# EAGLE schematic Mixer-Analog-OPA1644-Rev-C.s#6 (EAGLE 8.4.3)
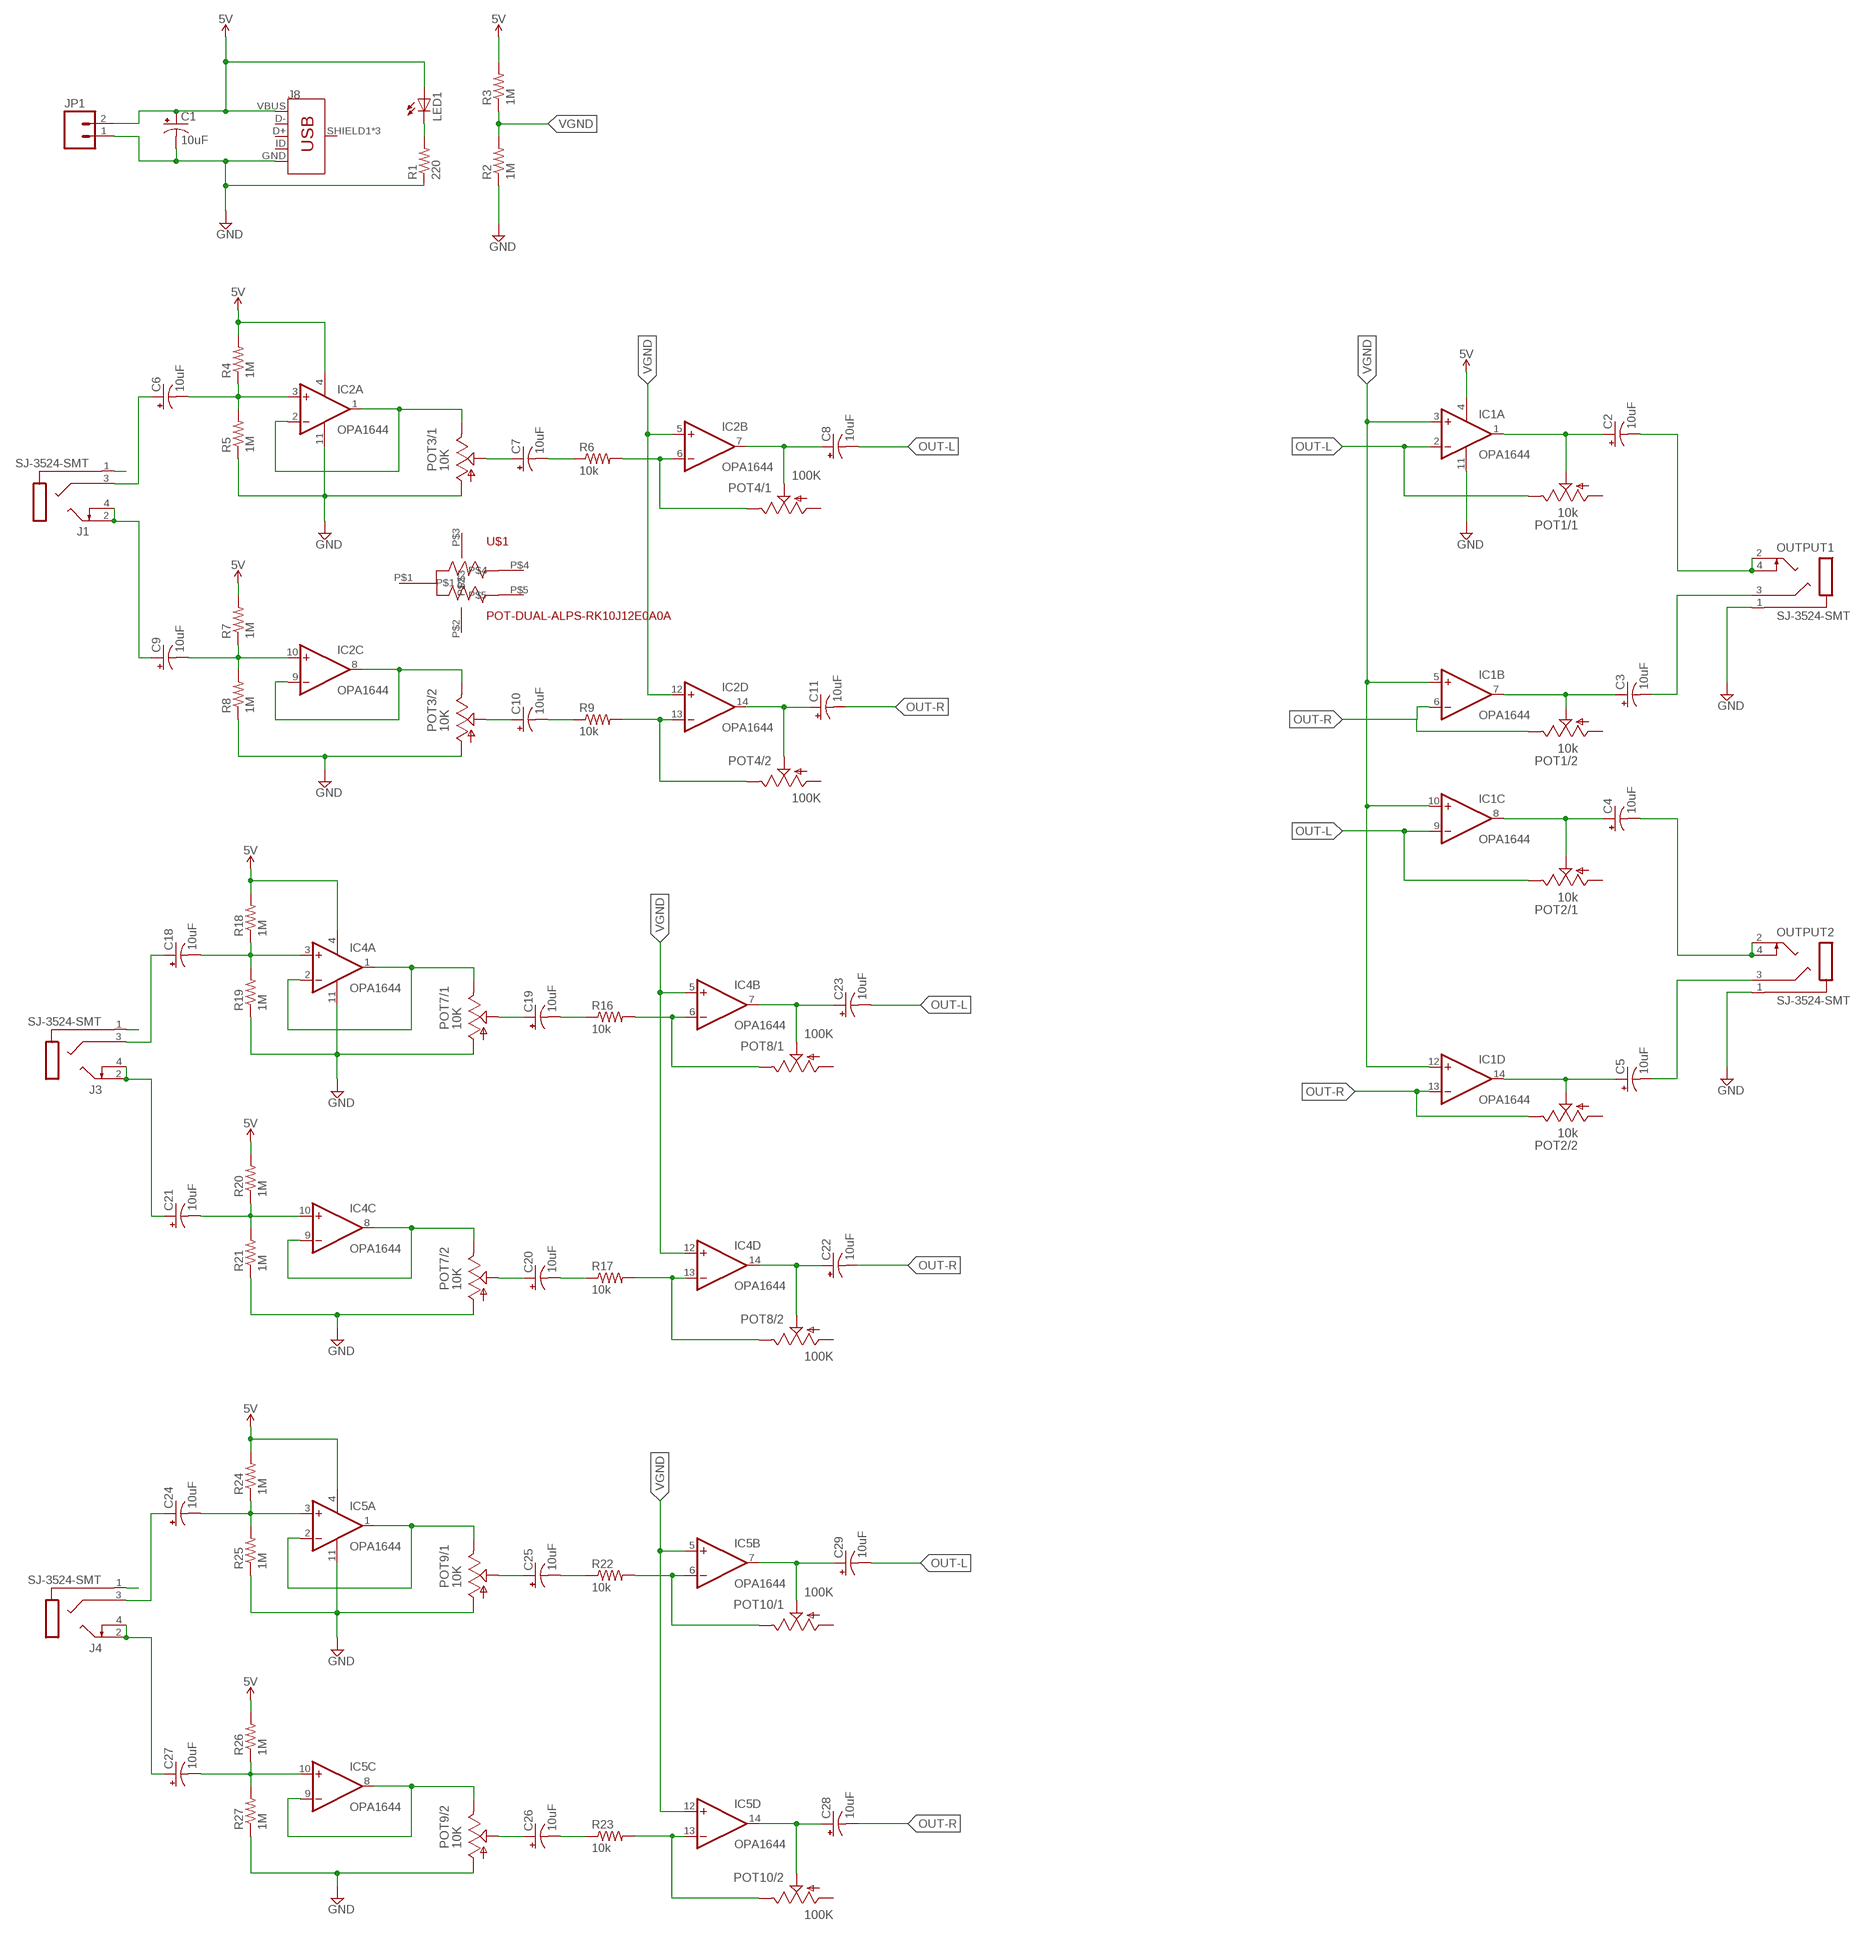
[diagram p0: schematic, sheet 1, part 1 of 2]
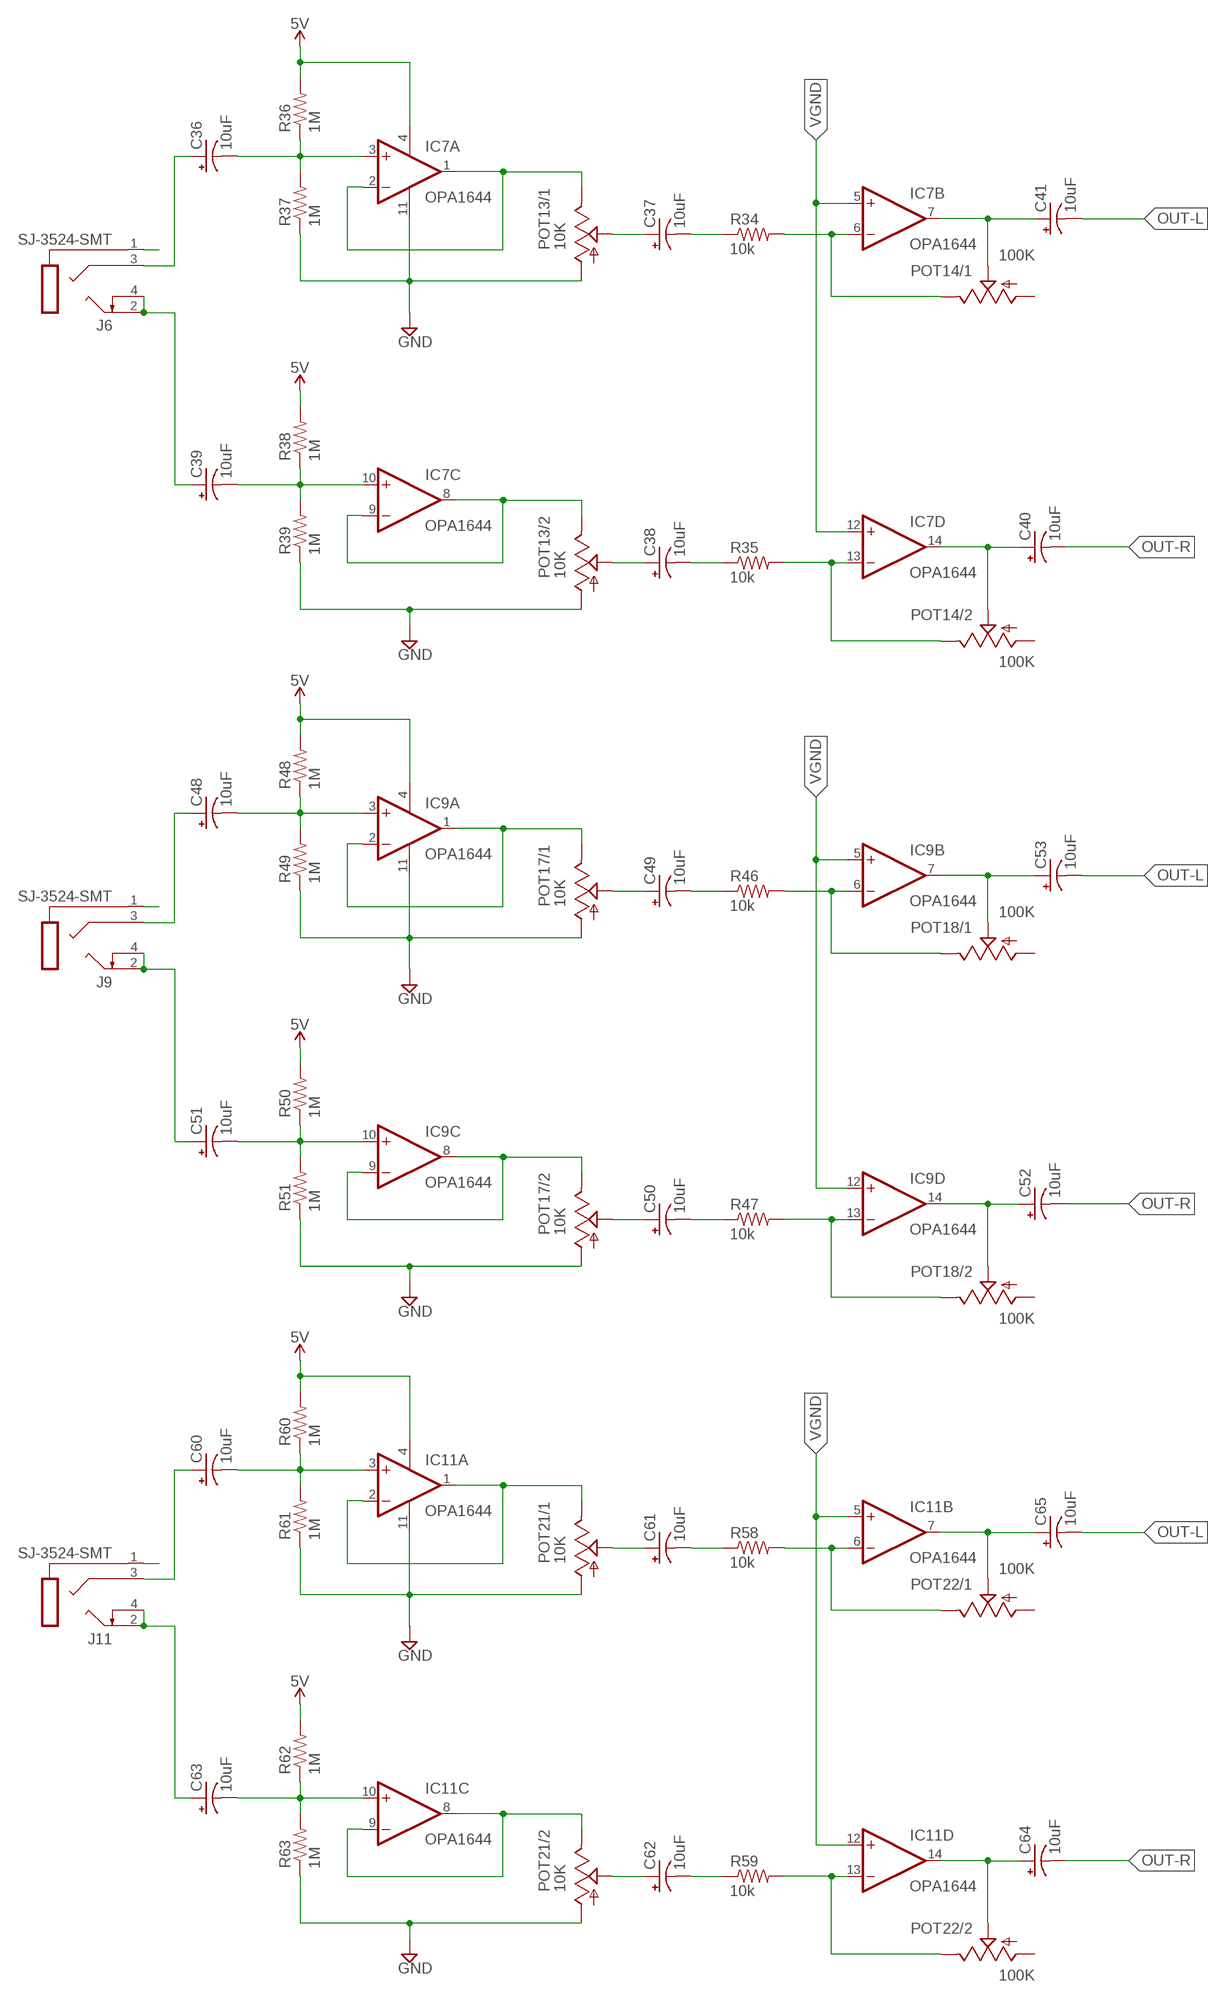
[diagram p1: schematic, sheet 1, part 2 of 2]

## Parts
C1  10uF  CAP_POL1206-KIT  [EIA3216-KIT]
C2  10uF  CAP_POL1206-KIT  [EIA3216-KIT]
C3  10uF  CAP_POL1206-KIT  [EIA3216-KIT]
C4  10uF  CAP_POL1206-KIT  [EIA3216-KIT]
C5  10uF  CAP_POL1206-KIT  [EIA3216-KIT]
C6  10uF  CAP_POL1206-KIT  [EIA3216-KIT]
C7  10uF  CAP_POL1206-KIT  [EIA3216-KIT]
C8  10uF  CAP_POL1206-KIT  [EIA3216-KIT]
C9  10uF  CAP_POL1206-KIT  [EIA3216-KIT]
C10  10uF  CAP_POL1206-KIT  [EIA3216-KIT]
C11  10uF  CAP_POL1206-KIT  [EIA3216-KIT]
C18  10uF  CAP_POL1206-KIT  [EIA3216-KIT]
C19  10uF  CAP_POL1206-KIT  [EIA3216-KIT]
C20  10uF  CAP_POL1206-KIT  [EIA3216-KIT]
C21  10uF  CAP_POL1206-KIT  [EIA3216-KIT]
C22  10uF  CAP_POL1206-KIT  [EIA3216-KIT]
C23  10uF  CAP_POL1206-KIT  [EIA3216-KIT]
C24  10uF  CAP_POL1206-KIT  [EIA3216-KIT]
C25  10uF  CAP_POL1206-KIT  [EIA3216-KIT]
C26  10uF  CAP_POL1206-KIT  [EIA3216-KIT]
C27  10uF  CAP_POL1206-KIT  [EIA3216-KIT]
C28  10uF  CAP_POL1206-KIT  [EIA3216-KIT]
C29  10uF  CAP_POL1206-KIT  [EIA3216-KIT]
C36  10uF  CAP_POL1206-KIT  [EIA3216-KIT]
C37  10uF  CAP_POL1206-KIT  [EIA3216-KIT]
C38  10uF  CAP_POL1206-KIT  [EIA3216-KIT]
C39  10uF  CAP_POL1206-KIT  [EIA3216-KIT]
C40  10uF  CAP_POL1206-KIT  [EIA3216-KIT]
C41  10uF  CAP_POL1206-KIT  [EIA3216-KIT]
C48  10uF  CAP_POL1206-KIT  [EIA3216-KIT]
C49  10uF  CAP_POL1206-KIT  [EIA3216-KIT]
C50  10uF  CAP_POL1206-KIT  [EIA3216-KIT]
C51  10uF  CAP_POL1206-KIT  [EIA3216-KIT]
C52  10uF  CAP_POL1206-KIT  [EIA3216-KIT]
C53  10uF  CAP_POL1206-KIT  [EIA3216-KIT]
C60  10uF  CAP_POL1206-KIT  [EIA3216-KIT]
C61  10uF  CAP_POL1206-KIT  [EIA3216-KIT]
C62  10uF  CAP_POL1206-KIT  [EIA3216-KIT]
C63  10uF  CAP_POL1206-KIT  [EIA3216-KIT]
C64  10uF  CAP_POL1206-KIT  [EIA3216-KIT]
C65  10uF  CAP_POL1206-KIT  [EIA3216-KIT]
IC1  OPA1644  [TSSOP14]
IC2  OPA1644  [TSSOP14]
IC4  OPA1644  [TSSOP14]
IC5  OPA1644  [TSSOP14]
IC7  OPA1644  [TSSOP14]
IC9  OPA1644  [TSSOP14]
IC11  OPA1644  [TSSOP14]
J1  SJ-3524-SMT  [SJ-3524-SMT]
J3  SJ-3524-SMT  [SJ-3524-SMT]
J4  SJ-3524-SMT  [SJ-3524-SMT]
J6  SJ-3524-SMT  [SJ-3524-SMT]
J8  USB_MICRO-B_FEMALE-SMT  [USB-B-MICRO-SMD]
J9  SJ-3524-SMT  [SJ-3524-SMT]
J11  SJ-3524-SMT  [SJ-3524-SMT]
JP1  M02LOCK  [1X02_LOCK]
LED1  LED3MM  [LED3MM]
OUTPUT1  SJ-3524-SMT  [SJ-3524-SMT]
OUTPUT2  SJ-3524-SMT  [SJ-3524-SMT]
POT1  10k  POT-DUAL-PTV112-4420  [PTV112]
POT2  10k  POT-DUAL-PTV112-4420  [PTV112]
POT3  10K  POT-DUAL-PTV112-4420  [PTV112]
POT4  100K  POT-DUAL-PTV112-4420  [PTV112]
POT7  10K  POT-DUAL-PTV112-4420  [PTV112]
POT8  100K  POT-DUAL-PTV112-4420  [PTV112]
POT9  10K  POT-DUAL-PTV112-4420  [PTV112]
POT10  100K  POT-DUAL-PTV112-4420  [PTV112]
POT13  10K  POT-DUAL-PTV112-4420  [PTV112]
POT14  100K  POT-DUAL-PTV112-4420  [PTV112]
POT17  10K  POT-DUAL-PTV112-4420  [PTV112]
POT18  100K  POT-DUAL-PTV112-4420  [PTV112]
POT21  10K  POT-DUAL-PTV112-4420  [PTV112]
POT22  100K  POT-DUAL-PTV112-4420  [PTV112]
R1  220  RESISTOR0603-RES  [0603-RES]
R2  1M  RESISTOR0603-RES  [0603-RES]
R3  1M  RESISTOR0603-RES  [0603-RES]
R4  1M  RESISTOR0603-RES  [0603-RES]
R5  1M  RESISTOR0603-RES  [0603-RES]
R6  10k  RESISTOR0603-RES  [0603-RES]
R7  1M  RESISTOR0603-RES  [0603-RES]
R8  1M  RESISTOR0603-RES  [0603-RES]
R9  10k  RESISTOR0603-RES  [0603-RES]
R16  10k  RESISTOR0603-RES  [0603-RES]
R17  10k  RESISTOR0603-RES  [0603-RES]
R18  1M  RESISTOR0603-RES  [0603-RES]
R19  1M  RESISTOR0603-RES  [0603-RES]
R20  1M  RESISTOR0603-RES  [0603-RES]
R21  1M  RESISTOR0603-RES  [0603-RES]
R22  10k  RESISTOR0603-RES  [0603-RES]
R23  10k  RESISTOR0603-RES  [0603-RES]
R24  1M  RESISTOR0603-RES  [0603-RES]
R25  1M  RESISTOR0603-RES  [0603-RES]
R26  1M  RESISTOR0603-RES  [0603-RES]
R27  1M  RESISTOR0603-RES  [0603-RES]
R34  10k  RESISTOR0603-RES  [0603-RES]
R35  10k  RESISTOR0603-RES  [0603-RES]
R36  1M  RESISTOR0603-RES  [0603-RES]
R37  1M  RESISTOR0603-RES  [0603-RES]
R38  1M  RESISTOR0603-RES  [0603-RES]
R39  1M  RESISTOR0603-RES  [0603-RES]
R46  10k  RESISTOR0603-RES  [0603-RES]
R47  10k  RESISTOR0603-RES  [0603-RES]
R48  1M  RESISTOR0603-RES  [0603-RES]
R49  1M  RESISTOR0603-RES  [0603-RES]
R50  1M  RESISTOR0603-RES  [0603-RES]
R51  1M  RESISTOR0603-RES  [0603-RES]
R58  10k  RESISTOR0603-RES  [0603-RES]
R59  10k  RESISTOR0603-RES  [0603-RES]
R60  1M  RESISTOR0603-RES  [0603-RES]
R61  1M  RESISTOR0603-RES  [0603-RES]
R62  1M  RESISTOR0603-RES  [0603-RES]
R63  1M  RESISTOR0603-RES  [0603-RES]
U$1  POT-DUAL-ALPS-RK10J12E0A0A  [POT-DUAL-ALPS-RK10J12E0A0A]

## Nets
5V: C1.A(+) IC1.4(P:V+) IC2.4(P:V+) IC4.4(P:V+) IC5.4(P:V+) IC7.4(P:V+) IC9.4(P:V+) IC11.4(P:V+) J8.VBUS JP1.2 LED1.A R3.2 R4.2 R7.2 R18.2 R20.2 R24.2 R26.2 R36.2 R38.2 R48.2 R50.2 R60.2 R62.2
COPY\: IC2.1(A:OUT) IC2.2(A:-IN) POT3.1.3(/1:E)
COPY\2: IC4.1(A:OUT) IC4.2(A:-IN) POT7.1.3(/1:E)
COPY\3: IC5.1(A:OUT) IC5.2(A:-IN) POT9.1.3(/1:E)
COPY\5: IC7.1(A:OUT) IC7.2(A:-IN) POT13.1.3(/1:E)
COPY\7: IC9.1(A:OUT) IC9.2(A:-IN) POT17.1.3(/1:E)
COPY\9: IC11.1(A:OUT) IC11.2(A:-IN) POT21.1.3(/1:E)
DLE: C8.A(+) IC2.7(B:OUT) POT4.1.2(/1:S)
DLE2: C23.A(+) IC4.7(B:OUT) POT8.1.2(/1:S)
DLE3: C29.A(+) IC5.7(B:OUT) POT10.1.2(/1:S)
DLE5: C41.A(+) IC7.7(B:OUT) POT14.1.2(/1:S)
DLE7: C53.A(+) IC9.7(B:OUT) POT18.1.2(/1:S)
DLE9: C65.A(+) IC11.7(B:OUT) POT22.1.2(/1:S)
GND: C1.C(-) IC1.11(P:V-) IC2.11(P:V-) IC4.11(P:V-) IC5.11(P:V-) IC7.11(P:V-) IC9.11(P:V-) IC11.11(P:V-) J8.GND JP1.1 OUTPUT1.1(S) OUTPUT2.1(S) POT3.1.1(/1:A) POT3.2.1(/2:A) POT7.1.1(/1:A) POT7.2.1(/2:A) POT9.1.1(/1:A) POT9.2.1(/2:A) POT13.1.1(/1:A) POT13.2.1(/2:A) POT17.1.1(/1:A) POT17.2.1(/2:A) POT21.1.1(/1:A) POT21.2.1(/2:A) R1.1 R2.1 R5.1 R8.1 R19.1 R21.1 R25.1 R27.1 R37.1 R39.1 R49.1 R51.1 R61.1 R63.1
N$1: IC2.13(D:-IN) POT4.2.3(/2:E) R9.2
N$3: C7.A(+) POT3.1.2(/1:S)
N$4: IC2.6(B:-IN) POT4.1.3(/1:E) R6.2
N$5: C6.C(-) IC2.3(A:+IN) R4.1 R5.2
N$6: J1.1(S)
N$7: C2.A(+) IC1.1(A:OUT) POT1.1.2(/1:S)
N$8: C7.C(-) R6.1
N$9: IC2.8(C:OUT) IC2.9(C:-IN) POT3.2.3(/2:E)
N$10: C6.A(+) J1.3(R)
N$11: C9.C(-) IC2.10(C:+IN) R7.1 R8.2
N$12: C9.A(+) J1.2(T) J1.4(TS)
N$13: C10.A(+) POT3.2.2(/2:S)
N$14: C10.C(-) R9.1
N$15: LED1.K(C) R1.2
N$17: C3.A(+) IC1.7(B:OUT) POT1.2.2(/2:S)
N$18: C4.C(-) OUTPUT2.2(T) OUTPUT2.4(TS)
N$19: C5.C(-) OUTPUT2.3(R)
N$21: C4.A(+) IC1.8(C:OUT) POT2.1.2(/1:S)
N$23: C5.A(+) IC1.14(D:OUT) POT2.2.2(/2:S)
N$24: C11.A(+) IC2.14(D:OUT) POT4.2.2(/2:S)
N$34: C22.A(+) IC4.14(D:OUT) POT8.2.2(/2:S)
N$35: J3.1(S)
N$36: IC4.13(D:-IN) POT8.2.3(/2:E) R17.2
N$37: IC4.8(C:OUT) IC4.9(C:-IN) POT7.2.3(/2:E)
N$38: C21.A(+) J3.2(T) J3.4(TS)
N$39: C18.C(-) IC4.3(A:+IN) R18.1 R19.2
N$40: C18.A(+) J3.3(R)
N$41: C21.C(-) IC4.10(C:+IN) R20.1 R21.2
N$42: C19.A(+) POT7.1.2(/1:S)
N$43: C19.C(-) R16.1
N$44: IC4.6(B:-IN) POT8.1.3(/1:E) R16.2
N$45: C20.A(+) POT7.2.2(/2:S)
N$46: C20.C(-) R17.1
N$47: C28.A(+) IC5.14(D:OUT) POT10.2.2(/2:S)
N$48: J4.1(S)
N$49: IC5.13(D:-IN) POT10.2.3(/2:E) R23.2
N$50: IC5.8(C:OUT) IC5.9(C:-IN) POT9.2.3(/2:E)
N$51: C27.A(+) J4.2(T) J4.4(TS)
N$52: C24.C(-) IC5.3(A:+IN) R24.1 R25.2
N$53: C24.A(+) J4.3(R)
N$54: C27.C(-) IC5.10(C:+IN) R26.1 R27.2
N$55: C25.A(+) POT9.1.2(/1:S)
N$56: C25.C(-) R22.1
N$57: IC5.6(B:-IN) POT10.1.3(/1:E) R22.2
N$58: C26.A(+) POT9.2.2(/2:S)
N$59: C26.C(-) R23.1
N$61: C2.C(-) OUTPUT1.2(T) OUTPUT1.4(TS)
N$62: C3.C(-) OUTPUT1.3(R)
N$75: C40.A(+) IC7.14(D:OUT) POT14.2.2(/2:S)
N$76: J6.1(S)
N$77: IC7.13(D:-IN) POT14.2.3(/2:E) R35.2
N$78: IC7.8(C:OUT) IC7.9(C:-IN) POT13.2.3(/2:E)
N$79: C39.A(+) J6.2(T) J6.4(TS)
N$80: C36.C(-) IC7.3(A:+IN) R36.1 R37.2
N$81: C36.A(+) J6.3(R)
N$82: C39.C(-) IC7.10(C:+IN) R38.1 R39.2
N$83: C37.A(+) POT13.1.2(/1:S)
N$84: C37.C(-) R34.1
N$85: IC7.6(B:-IN) POT14.1.3(/1:E) R34.2
N$86: C38.A(+) POT13.2.2(/2:S)
N$87: C38.C(-) R35.1
N$101: C52.A(+) IC9.14(D:OUT) POT18.2.2(/2:S)
N$102: J9.1(S)
N$103: IC9.13(D:-IN) POT18.2.3(/2:E) R47.2
N$104: IC9.8(C:OUT) IC9.9(C:-IN) POT17.2.3(/2:E)
N$105: C51.A(+) J9.2(T) J9.4(TS)
N$106: C48.C(-) IC9.3(A:+IN) R48.1 R49.2
N$107: C48.A(+) J9.3(R)
N$108: C51.C(-) IC9.10(C:+IN) R50.1 R51.2
N$109: C49.A(+) POT17.1.2(/1:S)
N$110: C49.C(-) R46.1
N$111: IC9.6(B:-IN) POT18.1.3(/1:E) R46.2
N$112: C50.A(+) POT17.2.2(/2:S)
N$113: C50.C(-) R47.1
N$127: C64.A(+) IC11.14(D:OUT) POT22.2.2(/2:S)
N$128: J11.1(S)
N$129: IC11.13(D:-IN) POT22.2.3(/2:E) R59.2
N$130: IC11.8(C:OUT) IC11.9(C:-IN) POT21.2.3(/2:E)
N$131: C63.A(+) J11.2(T) J11.4(TS)
N$132: C60.C(-) IC11.3(A:+IN) R60.1 R61.2
N$133: C60.A(+) J11.3(R)
N$134: C63.C(-) IC11.10(C:+IN) R62.1 R63.2
N$135: C61.A(+) POT21.1.2(/1:S)
N$136: C61.C(-) R58.1
N$137: IC11.6(B:-IN) POT22.1.3(/1:E) R58.2
N$138: C62.A(+) POT21.2.2(/2:S)
N$139: C62.C(-) R59.1
OUT-L: C8.C(-) C23.C(-) C29.C(-) C41.C(-) C53.C(-) C65.C(-) IC1.2(A:-IN) IC1.9(C:-IN) POT1.1.3(/1:E) POT2.1.3(/1:E)
OUT-R: C11.C(-) C22.C(-) C28.C(-) C40.C(-) C52.C(-) C64.C(-) IC1.6(B:-IN) IC1.13(D:-IN) POT1.2.3(/2:E) POT2.2.3(/2:E)
VGND: IC1.3(A:+IN) IC1.5(B:+IN) IC1.10(C:+IN) IC1.12(D:+IN) IC2.5(B:+IN) IC2.12(D:+IN) IC4.5(B:+IN) IC4.12(D:+IN) IC5.5(B:+IN) IC5.12(D:+IN) IC7.5(B:+IN) IC7.12(D:+IN) IC9.5(B:+IN) IC9.12(D:+IN) IC11.5(B:+IN) IC11.12(D:+IN) R2.2 R3.1
Unconnected: J8.D+ J8.D- J8.ID J8.SHIELD1(SHIELD) J8.SHIELD2(SHIELD) J8.SHIELD3(SHIELD) POT1.1.1(/1:A) POT1.2.1(/2:A) POT2.1.1(/1:A) POT2.2.1(/2:A) POT4.1.1(/1:A) POT4.2.1(/2:A) POT8.1.1(/1:A) POT8.2.1(/2:A) POT10.1.1(/1:A) POT10.2.1(/2:A) POT14.1.1(/1:A) POT14.2.1(/2:A) POT18.1.1(/1:A) POT18.2.1(/2:A) POT22.1.1(/1:A) POT22.2.1(/2:A) U$1.P$1 U$1.P$2 U$1.P$3 U$1.P$4 U$1.P$5

## Library data of the parts
C1-C5 = SparkFun-Passives:CAP_POL: Capacitor Polarized These are standard SMD and PTH capacitors. Normally 10uF, 47uF, and 100uF in electrolytic and tantalum varieties. Always verify the external diameter of the through hole cap, it varies with capacity, voltage, and manufacturer. The EIA devices should be standard.
C6-C11 C18-C29 C36-C41 C48-C53 C60-C65 = SparkFun-Passives:CAP_POL: Capacitor Polarized These are standard SMD and PTH capacitors. Normally 10uF, 47uF, and 100uF in electrolytic and tantalum varieties. Always verify the external diameter of the through hole cap, it varies with capacity, voltage, and manufacturer. The EIA devices should be standard.; SPICEPREFIX: C
IC1 = CMU-ArtFab:OPA1644: OPA164x SoundPlus™ High-Performance, JFET-Input Audio Operational Amplifiers Source: http://www.ti.com/lit/ds/symlink/opa1642.pdf
IC2 IC4 IC5 IC7 IC9 IC11 = CMU-ArtFab:OPA1644: OPA164x SoundPlus™ High-Performance, JFET-Input Audio Operational Amplifiers Source: http://www.ti.com/lit/ds/symlink/opa1642.pdf; SPICEPREFIX: B
J1 J3 J4 J6 J9 J11 = con-cuistack:SJ-3524: 3.5 Stereo audio jack (SMT); SPICEPREFIX: E
J8 = SparkFun-Connectors:USB_MICRO-B: USB Type Micro-B Connector Male/female and PTH/SMT variants SparkFun Products: SparkFun microB USB Breakout <https://www.sparkfun.com/products/12035> SparkFun USB microB Plug Breakout <https://www.sparkfun.com/products/10031> SparkFun ESP8266 Thing <https://www.sparkfun.com/products/13231>; PROD_ID: CONN-11752
JP1 = CMU-ArtFab:M02: Header 2 Standard 2-pin 0.1" header. Use with straight break away headers (SKU : PRT-00116), right angle break away headers (PRT-00553), swiss pins (PRT-00743), machine pins (PRT-00117), and female headers (PRT-00115). Molex polarized connector foot print use with SKU : PRT-08233 with associated crimp pins and housings.
LED1 = led:LED: LED OSRAM: - CHIPLED LG R971, LG N971, LY N971, LG Q971, LY Q971, LO R971, LY R971 LH N974, LH R974 LS Q976, LO Q976, LY Q976 LO Q996 - Hyper CHIPLED LW Q18S LB Q993, LB Q99A, LB R99A - SideLED LS A670, LO A670, LY A670, LG A670, LP A670 LB A673, LV A673, LT A673, LW A673 LH A674 LY A675 LS A676, LA A676, LO A676, LY A676, LW A676 LS A679, LY A679, LG A679 - Hyper Micro SIDELED® LS Y876, LA Y876, LO Y876, LY Y876 LT Y87S - SmartLED LW L88C, LW L88S LB L89C, LB L89S, LG L890 LS L89K, LO L89K, LY L89K LS L896, LA L896, LO L896, LY L896 - TOPLED LS T670, LO T670, LY T670, LG T670, LP T670 LSG T670, LSP T670, LSY T670, LOP T670, LYG T670 LG T671, LOG T671, LSG T671 LB T673, LV T673, LT T673, LW T673 LH T674 LS T676, LA T676, LO T676, LY T676, LB T676, LH T676, LSB T676, LW T676 LB T67C, LV T67C, LT T67C, LS T67K, LO T67K, LY T67K, LW E67C LS E67B, LA E67B, LO E67B, LY E67B, LB E67C, LV E67C, LT E67C LW T67C LS T679, LY T679, LG T679 LS T770, LO T770, LY T770, LG T770, LP T770 LB T773, LV T773, LT T773, LW T773 LH T774 LS E675, LA E675, LY E675, LS T675 LS T776, LA T776, LO T776, LY T776, LB T776 LHGB T686 LT T68C, LB T68C - Hyper Mini TOPLED® LB M676 - Mini TOPLED Santana® LG M470 LS M47K, LO M47K, LY M47K Source: http://www.osram.convergy.de LUXEON: - LUMILED® LXK2-PW12-R00, LXK2-PW12-S00, LXK2-PW14-U00, LXK2-PW14-V00 LXK2-PM12-R00, LXK2-PM12-S00, LXK2-PM14-U00 LXK2-PE12-Q00, LXK2-PE12-R00, LXK2-PE12-S00, LXK2-PE14-T00, LXK2-PE14-U00 LXK2-PB12-K00, LXK2-PB12-L00, LXK2-PB12-M00, LXK2-PB14-N00, LXK2-PB14-P00, LXK2-PB14-Q00 LXK2-PR12-L00, LXK2-PR12-M00, LXK2-PR14-Q00, LXK2-PR14-R00 LXK2-PD12-Q00, LXK2-PD12-R00, LXK2-PD12-S00 LXK2-PH12-R00, LXK2-PH12-S00 LXK2-PL12-P00, LXK2-PL12-Q00, LXK2-PL12-R00 Source: www.luxeon.com KINGBRIGHT: KA-3528ASYC Source: www.kingbright.com
OUTPUT1 OUTPUT2 = con-cuistack:SJ-3524: 3.5 Stereo audio jack (SMT)
POT1 POT2 = CMU-ArtFab:POT-DUAL-PTV112: Bourns 11mm dual potentiometer; AVAILABILITY: Unavailable; DESCRIPTION: Alt# Tce-10111410; MF: STMicroelectronics; MP: PTV112; PACKAGE: None; PRICE: None
POT3 POT4 POT7-POT10 POT13 POT14 POT17 POT18 POT21 POT22 = CMU-ArtFab:POT-DUAL-PTV112: Bourns 11mm dual potentiometer; AVAILABILITY: Unavailable; DESCRIPTION: Alt# Tce-10111410; MF: STMicroelectronics; MP: PTV112; PACKAGE: None; PRICE: None; SPICEPREFIX: J
R1-R3 = SparkFun-Passives:RESISTOR: Resistor Basic schematic elements and footprints for 0603, 1206, and PTH resistors.
R4-R9 R16-R27 R34-R39 R46-R51 R58-R63 = SparkFun-Passives:RESISTOR: Resistor Basic schematic elements and footprints for 0603, 1206, and PTH resistors.; SPICEPREFIX: R
U$1 = CMU-ArtFab:POT-DUAL-ALPS-RK10J12E0A0A